# Altium schematic sheet Power.SchDoc
size C
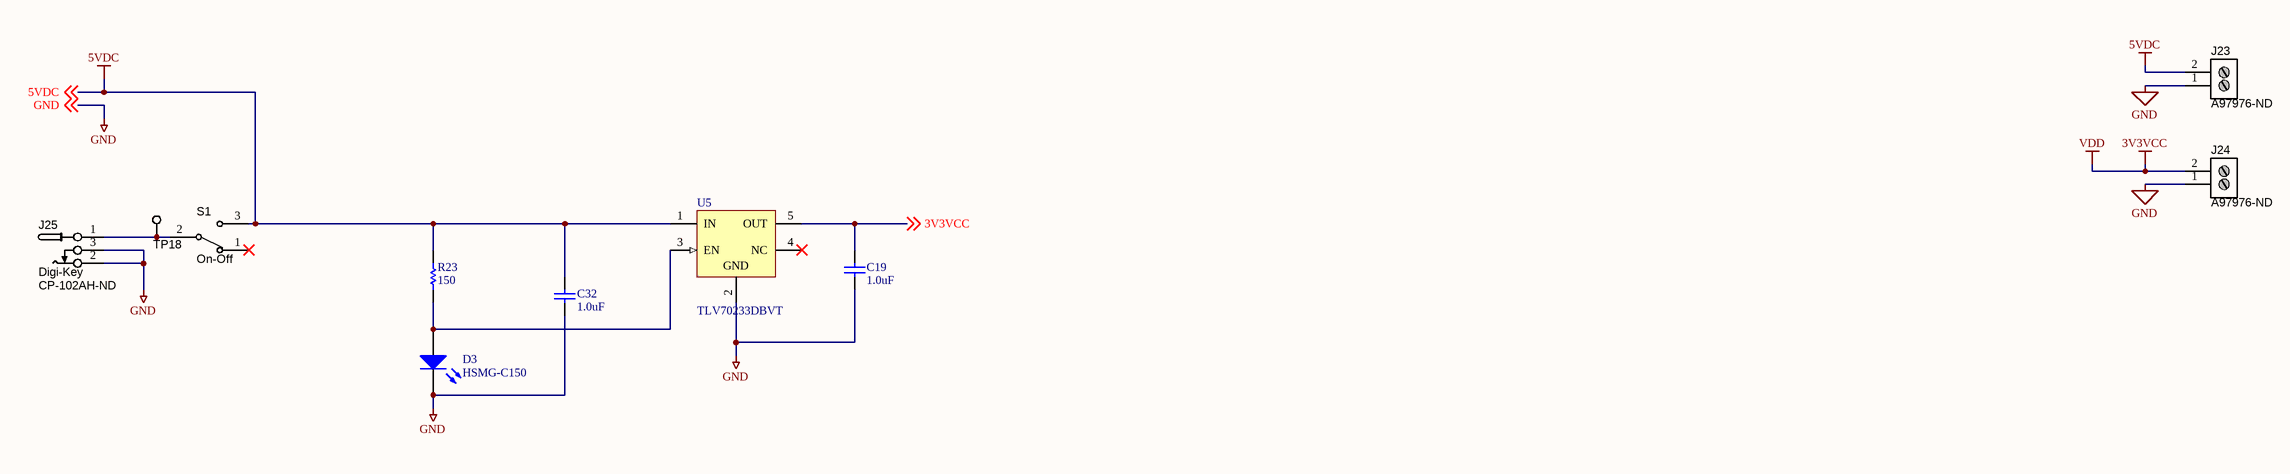
[diagram p0: Power.SchDoc]

## Parts
?  (no value)  (graphical)
C19  1.0uF  [cap_0805]
C32  1.0uF  [cap_0805]
D3  HSMG-C150  [3.2X1.6X1.1]
J23  Supplier Part Number 1: A97976-ND  [2P_PCB_ScrewTerm_90S_3.81MM]  (hidden comment: Stackable ScrewTerm)
J24  Supplier Part Number 1: A97976-ND  [2P_PCB_ScrewTerm_90S_3.81MM]  (hidden comment: Stackable ScrewTerm)
J25  Supplier 1: Digi-Key  Supplier Part Number 1: CP-102AH-ND  [CONN_PWR_JACK_2.1x5.5mm]  (hidden comment: CONN_PWR_JACK_2.1x5.5mm)
R23  150  [RES_0603]
S1  Switch Function: On-Off  [SWITCH_SPDT_SLIDER]  (hidden comment: ON-ON)
TP18  TESTPOINT_LEAD  [THP_D46_T80_B80]  (value not drawn)  (no BOM)
U5  TLV70233DBVT  [TI-DBV5_N]

## Nets
3V3VCC: C19.2 J24.2 U5.5(OUT) ; off-sheet 3V3VCC  [also labelled VDD]
5VDC: C32.2 J23.2 R23.2 S1.3 U5.1(IN) ; off-sheet 5VDC
GND: C19.1 C32.1 D3.2(K) J23.1 J24.1 J25.2 J25.3 U5.2(GND) ; off-sheet GND
NetD3_1: D3.1(A) R23.1 U5.3(EN)
NetJ25_1: J25.1 S1.2 TP18.1

Not connected (* = marked no-connect by the designer): S1 1*; U5 4(NC)*

## Notes on the sheet
- Title
- Size
- Date:
- Document Number
- Sheet
- of
- Rev

## Library data of the parts
? = Title Block Standard
C19 C32 = C0805C105K4RACTU: CAP CER 1UF 16V 10% X7R 0805; Manufacturer: Kemet; Capacitance: 1.0µF; Supplier 1: Digi-Key; Manufacturer Part Number: C0805C105K4RACTU; RoHS: RoHS Compliant; Category: Capacitors; Stock 1: 317806; Pricing 1: 1=0.12, 10=0.089, 50=0.0482, 100=0.0407, 250=0.03332, 500=0.0285, 1000=0.0222 (USD); Packaging: Cut Tape (CT); Voltage - Rated: 16V; Tolerance: ±10%; Temperature Coefficient: X7R; Mounting Type: Surface Mount, MLCC; Operating Temperature: -55°C ~ 125°C; Applications: General Purpose; Ratings: -; Package / Case: 0805 (2012 Metric); Size / Dimension: 0.079" L x 0.049" W (2.00mm x 1.25mm); Height - Seated (Max): -; Thickness (Max): 0.039" (1.00mm); Lead Spacing: -; Features: -; Lead Style: -; ComponentLink1URL: http://www.kemet.com/datasheets&C0805C105K4RACTU; ComponentLink1Description: http://www.kemet.com/datasheets&C0805C105K4RACTU; Value: 1.0uF; Supplier Part Number 1: 399-1284-1-ND
D3 = HSMG-C150: Surface Mount Chip LED, Green; LuminousIntensity: 4mcd (Minimum).; PCB_Layout: Complies with manufacturer's recommendation.; Published: 11-Dec-2002; DatasheetVersion: 30-Apr-2002; PackageVersion: Feb-2002; PackageReference: 3.2X1.6X1.1; Publisher: Altium Limited; PackageDescription: SM LED; 2 Flat Leads; LED_Colour: Green; ComponentLink1Description: Manufacturer Link; ComponentLink1URL: http://www.avagotech.com/; ComponentLink2Description: Datasheet; ComponentLink2URL: http://cp.literature.agilent.com/litweb/pdf/5988-6271EN.pdf
J23 J24 = 2P_ScrewTerm_90S_3.81MM: Terminal Block Screw Type THT 2-Position 3.81mm pitch; Manufacturer 1: Tyco Electronics; Manufacturer Part Number 1: 1776113-2; Value: 2 position; Pitch: 0.150" (3.81mm); Positions Per Level: 2; SCDType: undef; Package / Case: Side Entry; 3.81mm pitch; Category: Connectors Interconnects; Color: Black; Supplier 1: Digi-Key
J25 = CONN_PWR_JACK_2.1x5.5mm: Power Connector, THT, 2.1mm ID, 5.5mm OD; Manufacturer 1: CUI Inc; Manufacturer Part Number 1: PJ-102AH; SCDType: undef; Category: Connectors; Mounting Type: Through Hole; Package / Case: PCB mount; Value: 2.1mm ID, 5.5mm OD
R23 = ERJ-3EKF1500V: RES 150 OHM 1/10W 1% 0603 SMD; Manufacturer: Panasonic Electronic Components; Power (Watts): 0.1W, 1/10W; Temperature Coefficient: ±100ppm/°C; Supplier 1: Digi-Key; Manufacturer Part Number: ERJ-3EKF1500V; RoHS: RoHS Compliant; Category: Resistors; Stock 1: 279182; Pricing 1: 1=0.1, 50=0.015, 100=0.0114, 250=0.00844, 500=0.00624, 1000=0.00416, 2500=0.00351 (USD); Packaging: Cut Tape (CT); Resistance (Ohms): 150; Tolerance: ±1%; Composition: Thick Film; Features: -; Package / Case: 0603 (1608 Metric); Supplier Device Package: 0603; Size / Dimension: 0.063" L x 0.031" W (1.60mm x 0.80mm); Height: 0.022" (0.55mm); Number of Terminations: 2; ComponentLink1URL: http://industrial.panasonic.com/www-cgi/jvcr13pz.cgi?E+PZ+3+AOA0002+ERJ3EKF1500V+7+WW; ComponentLink1Description: http://industrial.panasonic.com/www-cgi/jvcr13pz.cgi?E+PZ+3+AOA0002+ERJ3EKF1500V+7+WW; Supplier Part Number 1: P150HCT-ND; Value: 150
S1 = SW_THD_SPDT_On-On: Switch THD vertical toggle SPDT; Manufacturer 1: TE Connectivity; Manufacturer Part Number 1: SLS121PC04; Contact Rating @ Voltage: 0.25A @ 125VAC; SCDType: spec; Circuit: SPDT; Mounting Type: PCB mount; Supplier 1: Digi-Key; Supplier Part Number 1: 450-1598-ND
TP18 = TESTPOINT_LEAD: TEST POINT
U5 = TLV70233DBVT: Single Output LDO, 300 mA, Fixed 3.3 V Output, 2 to 5.5 V Input, with Low IQ, 5-pin SOT-23 (DBV), -40 to 125 degC, Green (RoHS & no Sb/Br); Manufacturer: Texas Instruments; Accuracy(%): 2; Fixed Output Options(V): 3.3; Iout(Max)(A): 0.3; Iq(Typ)(mA): 0.03; SubFamily: Single Channel LDO; Vdo(Typ)(mV): 220; Vin(Max)(V): 5.5; DatasheetVersion: SLVSAG6B; PackageVersion: 4073253-4/K; PackageReference: DBV5; PackageDescription: 5-Pin Plastic Small Outline, Body 1.60 Ã— 2.90 mm, Pitch 0.95 mm; Supplier 1: Digi-Key; Supplier Part Number 1: 296-27895-2-ND; Supplier 2: Digi-Key; Supplier Part Number 2: 296-27895-1-ND; Supplier 3: Digi-Key; Supplier Part Number 3: 296-27895-6-ND; Supplier 4: Newark; Supplier Part Number 4: 13T5910; Supplier 5: Mouser; Supplier Part Number 5: 595-TLV70233DBVT; Eco-Plan: Green (RoHS & no Sb/Br); Vin(Min)(V): 2; Vout Adj(Max)(V): 3.3; Vout Adj(Min)(V): 3.3; Mounting Technology: Surface Mount; Code_JEDEC: MO-178; PartNumber: TLV70233DBVT; ComponentLink1Description: Manufacturer URL; ComponentLink1URL: http://www.ti.com/; ComponentLink2Description: Datasheet; ComponentLink2URL: http://www.ti.com/general/docs/lit/getliterature.tsp?genericPartNumber=TLV70233&fileType=pdf; ComponentLink3Description: Package Specification; ComponentLink3URL: http://www.ti.com/litv/pdf/mpds018i